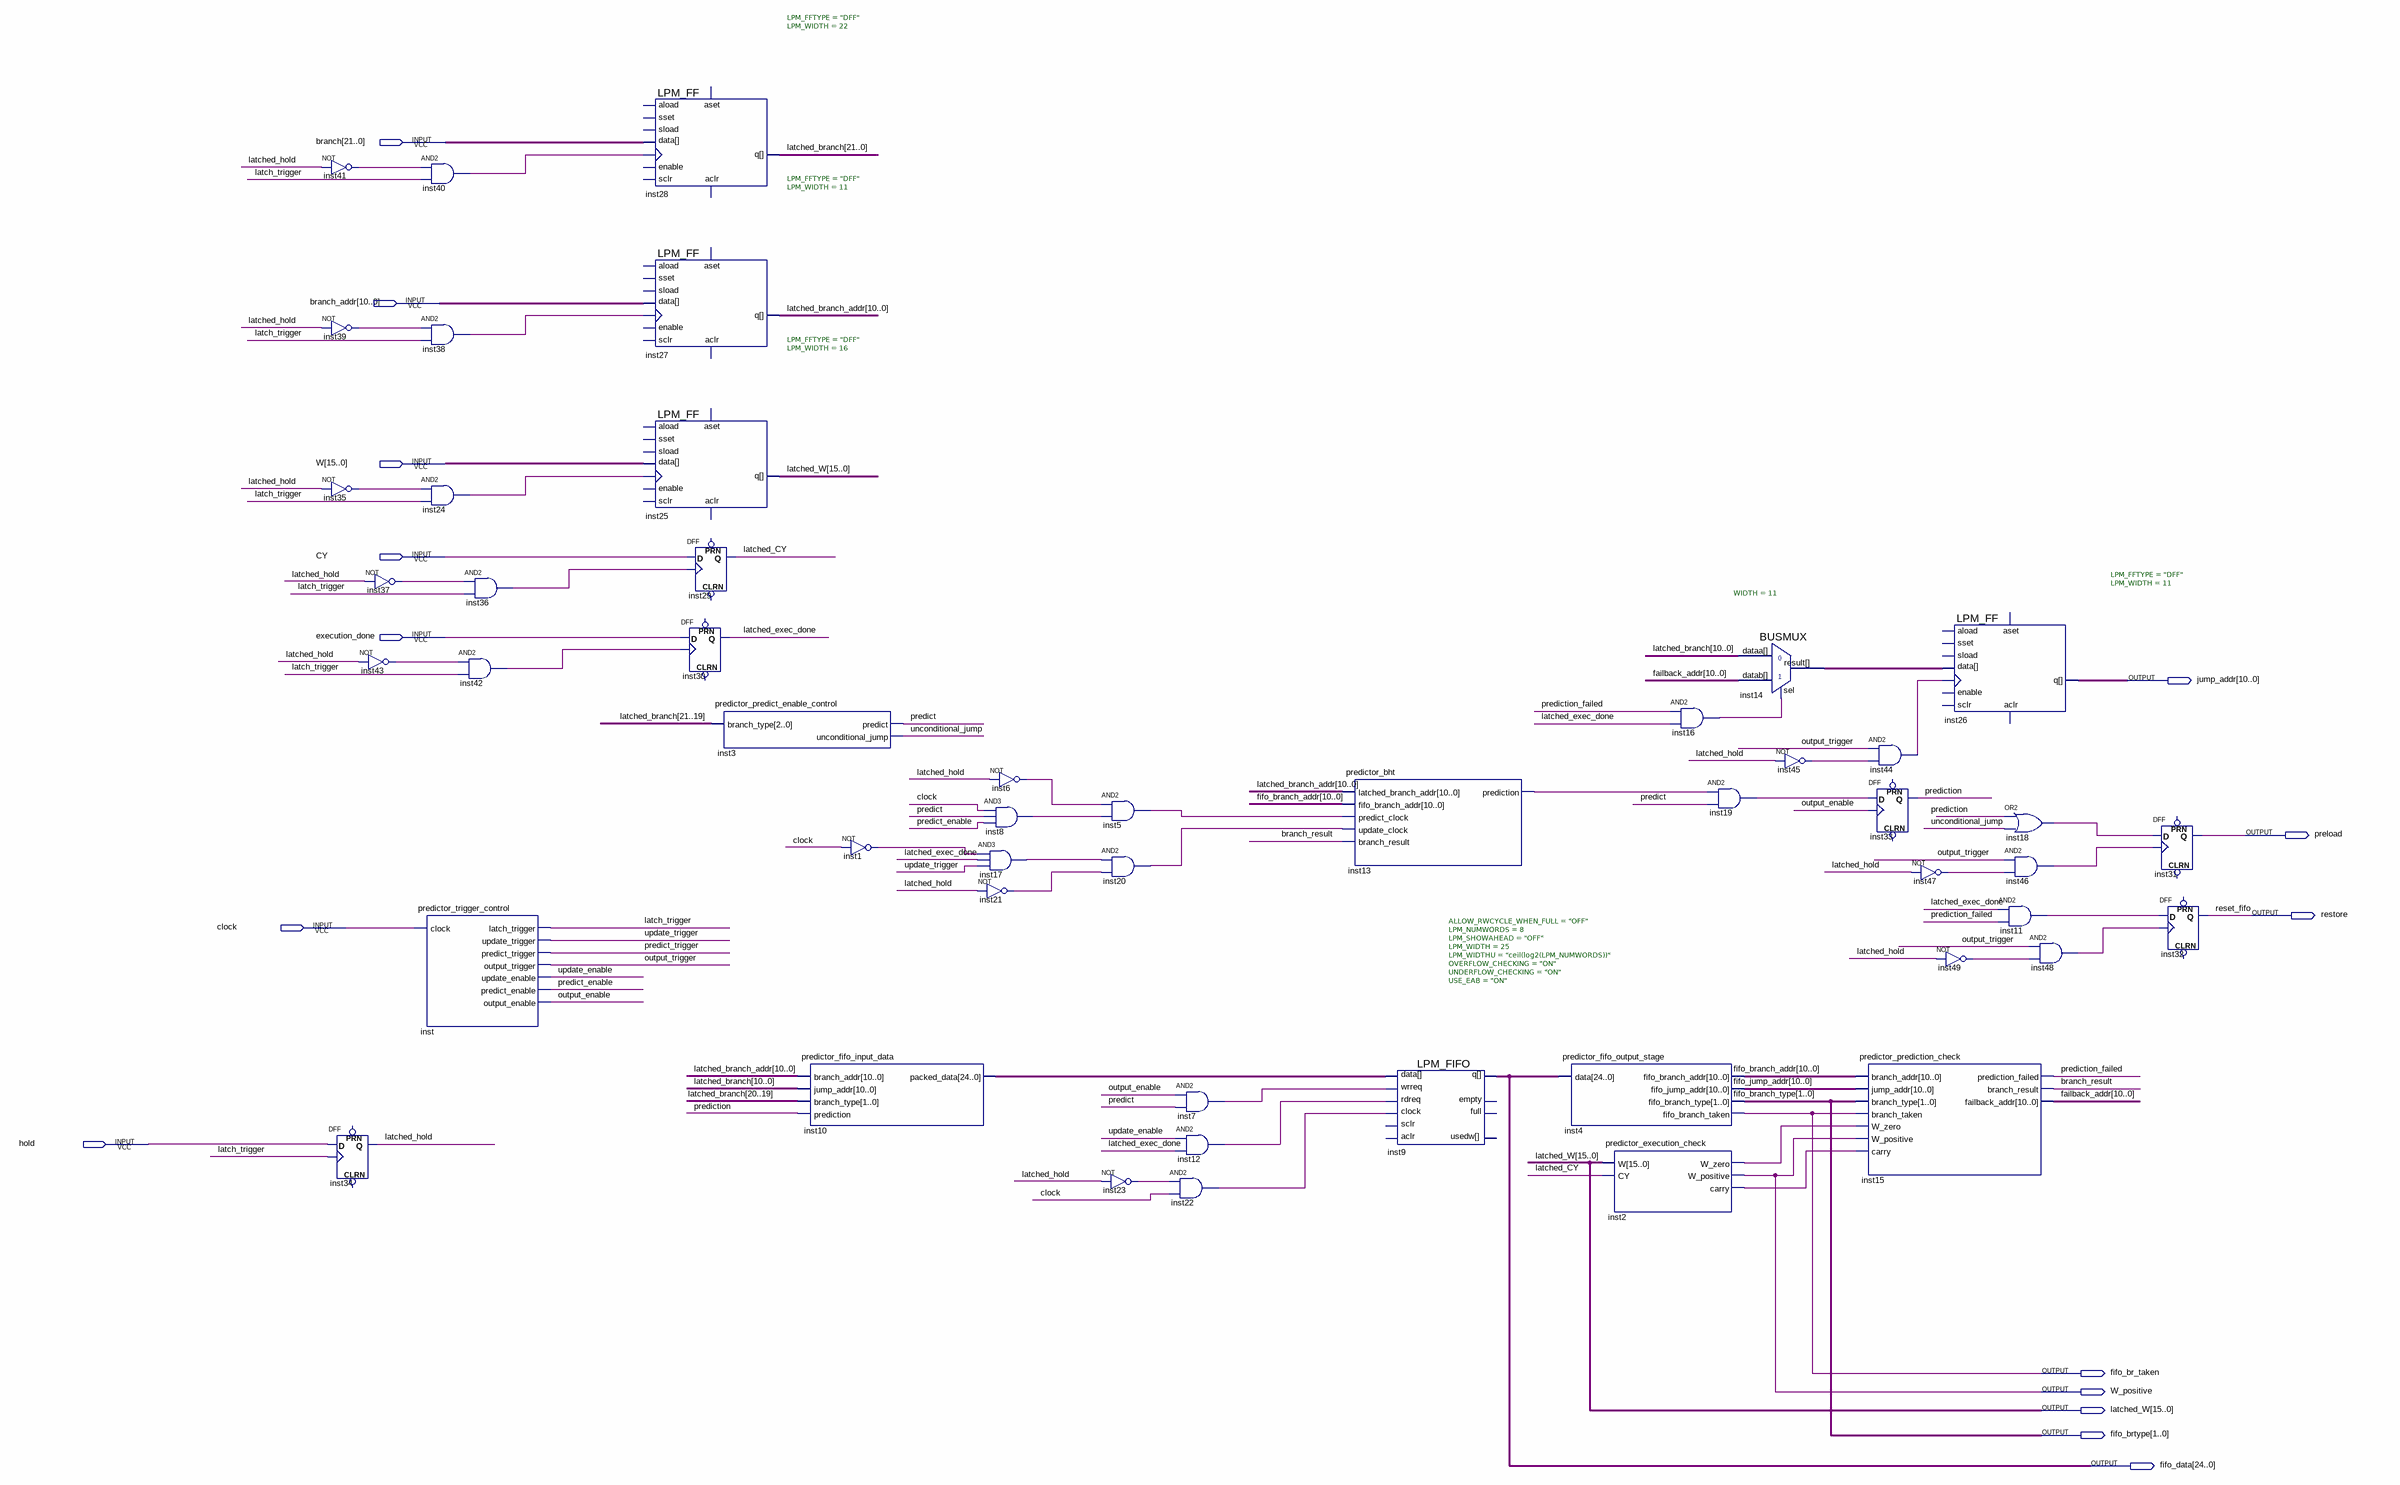
[diagram p0: schematic sheet]
// Quartus schematic branch_predictor.bdf as structural Verilog: 50 symbols, 15 pins
module branch_predictor (
  input  [21:0] branch,
  input  [10:0] branch_addr,
  input  [15:0] W,
  input  CY,
  input  execution_done,
  input  clock,
  input  hold,
  output [10:0] jump_addr,
  output preload,
  output restore,
  output fifo_br_taken,
  output W_positive,
  output [15:0] latched_W,
  output [1:0] fifo_brtype,
  output [24:0] fifo_data
);

  wire branch_result, inst1_out, inst2_carry, inst2_w_zero, inst5_out, inst6_out, inst7_out, inst8_out,
       inst11_out, inst12_out, inst13_prediction, inst16_out, inst17_out, inst18_out, inst19_out, inst20_out,
       inst21_out, inst22_out, inst23_out, inst24_out, inst35_out, inst36_out, inst37_out, inst38_out,
       inst39_out, inst40_out, inst41_out, inst42_out, inst43_out, inst44_out, inst45_out, inst46_out,
       inst47_out, inst48_out, inst49_out, latch_trigger, latched_CY, latched_exec_done, latched_hold,
       output_enable, output_trigger, predict, predict_enable, predict_trigger, prediction,
       prediction_failed, unconditional_jump, update_enable, update_trigger;
  wire [10:0] failback_addr, fifo_branch_addr, fifo_jump_addr, inst14_result, latched_branch_addr;
  wire [21:0] latched_branch;
  wire [24:0] inst10_packed_data;

  not inst41 (inst41_out, latched_hold);
  not inst39 (inst39_out, latched_hold);
  not inst35 (inst35_out, latched_hold);
  DFF inst34 (.CLK(latch_trigger), .D(hold), .Q(latched_hold));  // open: CLRN, PRN
  not inst37 (inst37_out, latched_hold);
  not inst43 (inst43_out, latched_hold);
  and inst40 (inst40_out, inst41_out, latch_trigger);
  and inst38 (inst38_out, inst39_out, latch_trigger);
  and inst24 (inst24_out, inst35_out, latch_trigger);
  predictor_trigger_control inst (
    .clock(clock), .latch_trigger(latch_trigger), .update_trigger(update_trigger),
    .predict_trigger(predict_trigger), .output_trigger(output_trigger), .update_enable(update_enable),
    .predict_enable(predict_enable), .output_enable(output_enable));
  and inst36 (inst36_out, inst37_out, latch_trigger);
  and inst42 (inst42_out, inst43_out, latch_trigger);
  LPM_FF #(.LPM_FFTYPE("DFF"), .LPM_WIDTH(22)) inst28 (
    .clock(inst40_out), .data(branch), .q(latched_branch));  // open: enable, aload, sset, sload, aset, sclr, aclr
  LPM_FF #(.LPM_FFTYPE("DFF"), .LPM_WIDTH(11)) inst27 (
    .clock(inst38_out), .data(branch_addr), .q(latched_branch_addr));  // open: enable, aload, sset, sload, aset, sclr, aclr
  LPM_FF #(.LPM_FFTYPE("DFF"), .LPM_WIDTH(16)) inst25 (
    .clock(inst24_out), .data(W), .q(latched_W));  // open: enable, aload, sset, sload, aset, sclr, aclr
  DFF inst30 (.CLK(inst42_out), .D(execution_done), .Q(latched_exec_done));  // open: CLRN, PRN
  DFF inst29 (.CLK(inst36_out), .D(CY), .Q(latched_CY));  // open: CLRN, PRN
  predictor_predict_enable_control inst3 (
    .branch_type(latched_branch[21:19]), .predict(predict), .unconditional_jump(unconditional_jump));
  predictor_fifo_input_data inst10 (
    .branch_addr(latched_branch_addr), .jump_addr(latched_branch[10:0]), .branch_type(latched_branch[20:19]),
    .prediction(prediction), .packed_data(inst10_packed_data));
  not inst1 (inst1_out, clock);
  and inst17 (inst17_out, inst1_out, latched_exec_done, update_trigger);
  not inst21 (inst21_out, latched_hold);
  not inst6 (inst6_out, latched_hold);
  and inst8 (inst8_out, clock, predict, predict_enable);
  and inst5 (inst5_out, inst6_out, inst8_out);
  and inst20 (inst20_out, inst17_out, inst21_out);
  not inst23 (inst23_out, latched_hold);
  and inst7 (inst7_out, output_enable, predict);
  and inst12 (inst12_out, update_enable, latched_exec_done);
  and inst22 (inst22_out, inst23_out, clock);
  predictor_bht inst13 (
    .latched_branch_addr(latched_branch_addr), .fifo_branch_addr(fifo_branch_addr),
    .predict_clock(inst5_out), .update_clock(inst20_out), .branch_result(branch_result),
    .prediction(inst13_prediction));
  LPM_FIFO #(.ALLOW_RWCYCLE_WHEN_FULL("OFF"), .LPM_NUMWORDS(8), .LPM_SHOWAHEAD("OFF"), .LPM_WIDTH(25), .LPM_WIDTHU("ceil(log2(LPM_NUMWORDS))"), .OVERFLOW_CHECKING("ON"), .UNDERFLOW_CHECKING("ON"), .USE_EAB("ON")) inst9 (
    .clock(inst22_out), .data(inst10_packed_data), .wrreq(inst7_out), .rdreq(inst12_out), .q(fifo_data));  // open: aclr, sclr, empty, full, usedw
  predictor_fifo_output_stage inst4 (
    .data(fifo_data), .fifo_branch_addr(fifo_branch_addr), .fifo_jump_addr(fifo_jump_addr),
    .fifo_branch_type(fifo_brtype), .fifo_branch_taken(fifo_br_taken));
  predictor_execution_check inst2 (
    .W(latched_W), .CY(latched_CY), .W_zero(inst2_w_zero), .W_positive(W_positive), .carry(inst2_carry));
  and inst16 (inst16_out, prediction_failed, latched_exec_done);
  and inst19 (inst19_out, inst13_prediction, predict);
  BUSMUX #(.WIDTH(11)) inst14 (
    .datab(failback_addr), .sel(inst16_out), .dataa(latched_branch[10:0]), .result(inst14_result));
  not inst45 (inst45_out, latched_hold);
  and inst44 (inst44_out, output_trigger, inst45_out);
  DFF inst33 (.CLK(output_enable), .D(inst19_out), .Q(prediction));  // open: CLRN, PRN
  predictor_prediction_check inst15 (
    .branch_addr(fifo_branch_addr), .jump_addr(fifo_jump_addr), .branch_type(fifo_brtype),
    .branch_taken(fifo_br_taken), .W_zero(inst2_w_zero), .W_positive(W_positive), .carry(inst2_carry),
    .prediction_failed(prediction_failed), .branch_result(branch_result), .failback_addr(failback_addr));
  not inst47 (inst47_out, latched_hold);
  LPM_FF #(.LPM_FFTYPE("DFF"), .LPM_WIDTH(11)) inst26 (
    .clock(inst44_out), .data(inst14_result), .q(jump_addr));  // open: enable, aload, sset, sload, aset, sclr, aclr
  not inst49 (inst49_out, latched_hold);
  or inst18 (inst18_out, prediction, unconditional_jump);
  and inst46 (inst46_out, output_trigger, inst47_out);
  and inst11 (inst11_out, latched_exec_done, prediction_failed);
  and inst48 (inst48_out, output_trigger, inst49_out);
  DFF inst31 (.CLK(inst46_out), .D(inst18_out), .Q(preload));  // open: CLRN, PRN
  DFF inst32 (.CLK(inst48_out), .D(inst11_out), .Q(restore));  // open: CLRN, PRN

  // Other names for the same wires on the sheet: fifo_branch_type[1:0] = fifo_brtype; reset_fifo = restore
endmodule
